# Altium schematic sheet POWER_RK806.SchDoc (part 2 of 2)
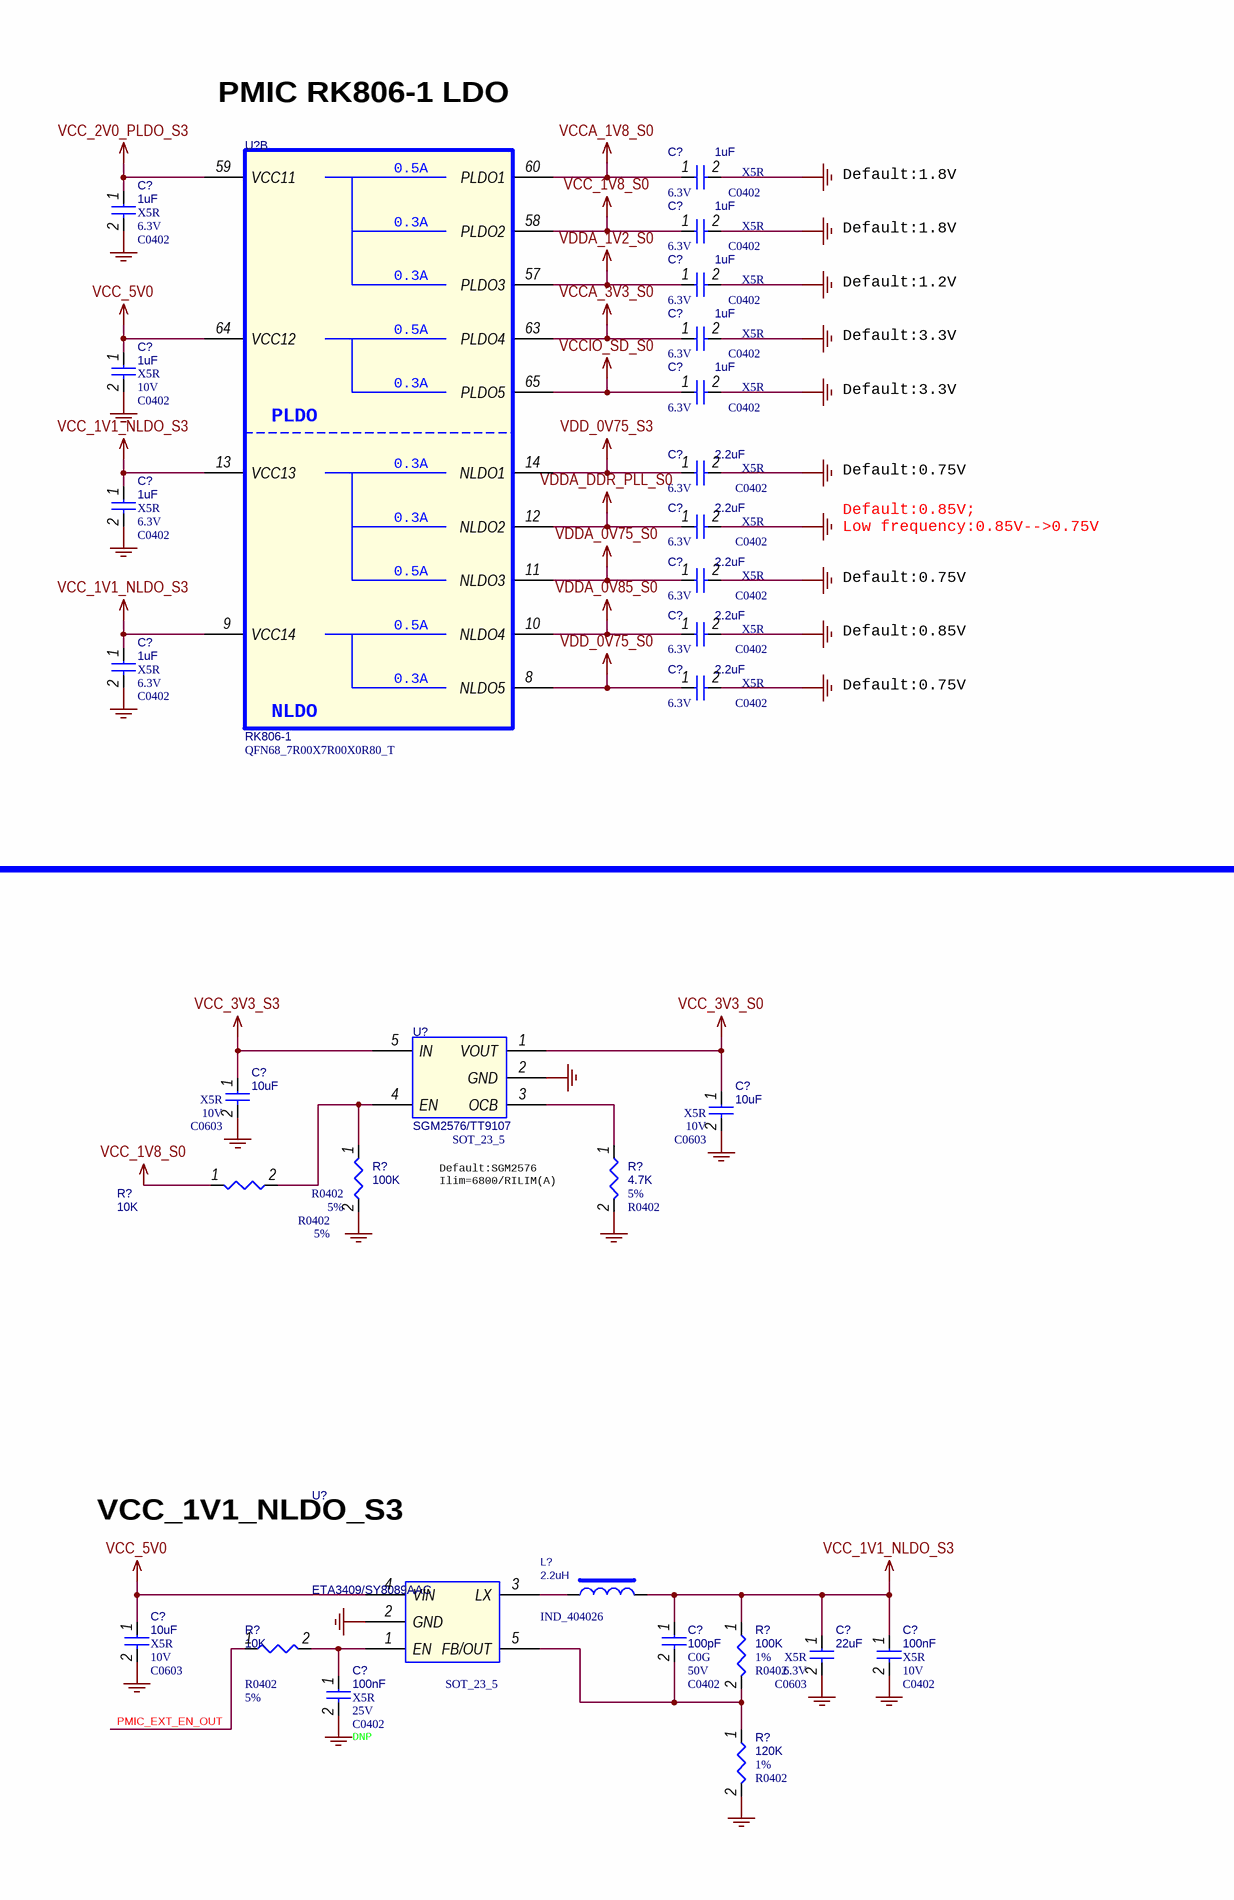
[diagram p2: POWER_RK806.SchDoc, right]

## Library data of the parts
C?#1 = CAP NP_Dup1: cap,10.00uF,+/-10%,10V,X5R,C0603; Part Reference: C2200; Manufacturer PN: C1608X5R1A106K080AC; Manufacturer: TDK; Tolerance: 10%; C_Voltage: 6.3V; Priority: A; PCB Footprint: C0603; Value: 10uF; Created by: JJJ; Part Type: C0603; RK PN: C1608X5R1A106K080AC
C?#2 = CAP NP_Dup1: cap,22.00uF,+/-10%,10V,X5R,C0805; Part Reference: C2201; Manufacturer: TDK; RK PN: C2012X5R1A226K125AB; Priority: A; C_Voltage: 6.3V; Tolerance: 10%; PCB Footprint: C0805; Value: 22uF; Part Type: C0805; Manufacturer PN: C2012X5R1A226K125AB; Created by: JJJ
C?#3 = CAP NP_Dup1: cap,22.00uF,+/-20%,6.3V,X5R,C0603; Part Reference: C2202; Manufacturer: TDK; RK PN: C1608X5R0J226M080AC; Priority: A; Tolerance: 20%; PCB Footprint: C0603; Value: 22uF; Part Type: C0603; C_Voltage: 6.3V; Manufacturer PN: C1608X5R0J226M080AC; Created by: JJJ
C?#4 = CAP NP_Dup1: cap,22.00uF,+/-20%,6.3V,X5R,C0603; Part Reference: C2203; Manufacturer PN: C1608X5R0J226M080AC; Manufacturer: TDK; Tolerance: 20%; Priority: A; PCB Footprint: C0603; Value: 22uF; Created by: JJJ; C_Voltage: 6.3V; Part Type: C0603; RK PN: C1608X5R0J226M080AC
C?#5 = CAP NP_Dup1: cap,10.00uF,+/-10%,6.3V,X5R,C0603; Part Reference: C2204; Manufacturer PN: C1608X5R0J106K080AB; Manufacturer: TDK; Tolerance: 10%; Priority: A; PCB Footprint: C0603; Value: 10uF; Created by: JJJ; C_Voltage: 6.3V; Part Type: C0603; RK PN: C1608X5R0J106K080AB
C?#6 = CAP NP_Dup1: cap,1.00uF,+/-10%,10V,X5R,C0402; Part Reference: C2206; Manufacturer: TDK; RK PN: C1005X5R1A105K050BB; Priority: A; Tolerance: 10%; PCB Footprint: C0402; Value: 1uF; Part Type: C0402; Manufacturer PN: C1005X5R1A105K050BB; Created by: JJJ
C?#7 = CAP NP_Dup1: cap,47.00uF,+/-20%,6.3V,X5R,C0805; Part Reference: C2207; Manufacturer: TDK; RK PN: C2012X5R0J476M125AC; Priority: A; Tolerance: 20%; PCB Footprint: C0805; Value: 47uF; Part Type: C0805; C_Voltage: 6.3V; Manufacturer PN: C2012X5R0J476M125AC; Created by: JJJ
C?#8 = CAP NP_Dup1: cap,47.00uF,+/-20%,6.3V,X5R,C0805; Part Reference: C2208; Manufacturer: TDK; RK PN: C2012X5R0J476M125AC; Priority: A; Tolerance: 20%; PCB Footprint: C0805; Value: 47uF; Part Type: C0805; C_Voltage: 6.3V; Manufacturer PN: C2012X5R0J476M125AC; Created by: JJJ
C?#9 = CAP NP_Dup1: cap,22.00uF,+/-20%,6.3V,X5R,C0603; Part Reference: C2211; Manufacturer: TDK; RK PN: C1608X5R0J226M080AC; Priority: A; Tolerance: 20%; PCB Footprint: C0603; Value: 22uF; Part Type: C0603; C_Voltage: 6.3V; Manufacturer PN: C1608X5R0J226M080AC; Created by: JJJ
C?#10 = CAP NP_Dup1: cap,22.00uF,+/-20%,6.3V,X5R,C0603; Part Reference: C2209; Manufacturer: TDK; RK PN: C1608X5R0J226M080AC; Priority: A; Tolerance: 20%; PCB Footprint: C0603; Value: 22uF; Part Type: C0603; C_Voltage: 6.3V; Manufacturer PN: C1608X5R0J226M080AC; Created by: JJJ
C?#11 = CAP NP_Dup1: cap,1.00uF,+/-10%,10V,X5R,C0402; Part Reference: C2205; Manufacturer: TDK; RK PN: C1005X5R1A105K050BB; Priority: A; Tolerance: 10%; PCB Footprint: C0402; Value: 1uF; Part Type: C0402; Manufacturer PN: C1005X5R1A105K050BB; Created by: JJJ
C?#12 = CAP NP_Dup1: cap,10.00uF,+/-10%,10V,X5R,C0603; Part Reference: C2210; Manufacturer PN: C1608X5R1A106K080AC; Manufacturer: TDK; Tolerance: 10%; C_Voltage: 6.3V; Priority: A; PCB Footprint: C0603; Value: 10uF; Created by: JJJ; Part Type: C0603; RK PN: C1608X5R1A106K080AC
C?#13 = CAP NP_Dup1: cap,22.00uF,+/-10%,10V,X5R,C0805; Part Reference: C2212; Manufacturer: TDK; RK PN: C2012X5R1A226K125AB; Priority: A; C_Voltage: 6.3V; Tolerance: 10%; PCB Footprint: C0805; Value: 22uF; Part Type: C0805; Manufacturer PN: C2012X5R1A226K125AB; Created by: JJJ
C?#14 C?#16 C?#26 C?#27 C?#29 = CAP NP_Dup1: cap,1.00uF,+/-10%,6.3V,X5R,C0402; Part Reference: C2253; Manufacturer PN: C1005X5R0J105K050BB; Manufacturer: TDK; Tolerance: 10%; Priority: A; PCB Footprint: C0402; Value: 1uF; Created by: JJJ; C_Voltage: 6.3V; Part Type: C0402; RK PN: C1005X5R0J105K050BB
C?#15 = CAP NP_Dup1: cap,1.00uF,+/-10%,6.3V,X5R,C0402; Part Reference: C2252; Manufacturer: TDK; RK PN: C1005X5R0J105K050BB; Priority: A; Tolerance: 10%; PCB Footprint: C0402; Value: 1uF; Part Type: C0402; C_Voltage: 6.3V; Manufacturer PN: C1005X5R0J105K050BB; Created by: JJJ
C?#17 = CAP NP_Dup1: cap,22.00uF,+/-20%,6.3V,X5R,C0603; Part Reference: C2213; Manufacturer: TDK; RK PN: C1608X5R0J226M080AC; Priority: A; Tolerance: 20%; PCB Footprint: C0603; Value: 22uF; Part Type: C0603; C_Voltage: 6.3V; Manufacturer PN: C1608X5R0J226M080AC; Created by: JJJ
C?#18 = CAP NP_Dup1: cap,22.00uF,+/-20%,6.3V,X5R,C0603; Part Reference: C2214; Manufacturer PN: C1608X5R0J226M080AC; Manufacturer: TDK; Tolerance: 20%; Priority: A; PCB Footprint: C0603; Value: 22uF; Created by: JJJ; C_Voltage: 6.3V; Part Type: C0603; RK PN: C1608X5R0J226M080AC
C?#19 = CAP NP_Dup1: cap,10.00uF,+/-10%,6.3V,X5R,C0603; Part Reference: C2215; Manufacturer PN: C1608X5R0J106K080AB; Manufacturer: TDK; Tolerance: 10%; Priority: A; PCB Footprint: C0603; Value: 10uF; Created by: JJJ; C_Voltage: 6.3V; Part Type: C0603; RK PN: C1608X5R0J106K080AB
C?#20 = CAP NP_Dup1: cap,1.00uF,+/-10%,10V,X5R,C0402; Part Reference: C2217; Manufacturer: TDK; RK PN: C1005X5R1A105K050BB; Priority: A; Tolerance: 10%; PCB Footprint: C0402; Value: 1uF; Part Type: C0402; Manufacturer PN: C1005X5R1A105K050BB; Created by: JJJ
C?#21 = CAP NP_Dup1: cap,22.00uF,+/-20%,6.3V,X5R,C0603; Part Reference: C2218; Manufacturer PN: C1608X5R0J226M080AC; Manufacturer: TDK; Tolerance: 20%; Priority: A; PCB Footprint: C0603; Value: 22uF; Created by: JJJ; C_Voltage: 6.3V; Part Type: C0603; RK PN: C1608X5R0J226M080AC
C?#22 = CAP NP_Dup1: cap,22.00uF,+/-20%,6.3V,X5R,C0603; Part Reference: C2219; Manufacturer: TDK; RK PN: C1608X5R0J226M080AC; Priority: A; Tolerance: 20%; PCB Footprint: C0603; Value: 22uF; Part Type: C0603; C_Voltage: 6.3V; Manufacturer PN: C1608X5R0J226M080AC; Created by: JJJ
C?#23 = CAP NP_Dup1: cap,22.00uF,+/-20%,6.3V,X5R,C0603; Part Reference: C2220; Manufacturer PN: C1608X5R0J226M080AC; Manufacturer: TDK; Tolerance: 20%; Priority: A; PCB Footprint: C0603; Value: 22uF; Created by: JJJ; C_Voltage: 6.3V; Part Type: C0603; RK PN: C1608X5R0J226M080AC
C?#24 = CAP NP_Dup1: cap,22.00uF,+/-20%,6.3V,X5R,C0603; Part Reference: C2221; Manufacturer PN: C1608X5R0J226M080AC; Manufacturer: TDK; Tolerance: 20%; Priority: A; PCB Footprint: C0603; Value: 22uF; Created by: JJJ; C_Voltage: 6.3V; Part Type: C0603; RK PN: C1608X5R0J226M080AC
C?#25 = CAP NP_Dup1: cap,100.00pF,+/-10%,50V,C0G,C0402; Part Reference: C2216; Manufacturer: TDK; RK PN: C1005C0G1H101K050BA; Priority: A; Tolerance: 10%; PCB Footprint: C0402; Value: 100pF; Part Type: C0402; Manufacturer PN: C1005C0G1H101K050BA; Created by: JJJ
C?#28 = CAP NP_Dup1: cap,1.00uF,+/-10%,10V,X5R,C0402; Part Reference: C2258; Manufacturer: TDK; RK PN: C1005X5R1A105K050BB; Priority: A; C_Voltage: 6.3V; Tolerance: 10%; PCB Footprint: C0402; Value: 1uF; Part Type: C0402; Manufacturer PN: C1005X5R1A105K050BB; Created by: JJJ
C?#30 = CAP NP_Dup1: cap,10.00uF,+/-10%,10V,X5R,C0603; Part Reference: C2222; Manufacturer PN: C1608X5R1A106K080AC; Manufacturer: TDK; Tolerance: 10%; C_Voltage: 6.3V; Priority: A; PCB Footprint: C0603; Value: 10uF; Created by: JJJ; Part Type: C0603; RK PN: C1608X5R1A106K080AC
C?#31 = CAP NP_Dup1: cap,22.00uF,+/-10%,10V,X5R,C0805; Part Reference: C2223; Manufacturer: TDK; RK PN: C2012X5R1A226K125AB; Priority: A; C_Voltage: 6.3V; Tolerance: 10%; PCB Footprint: C0805; Value: 22uF; Part Type: C0805; Manufacturer PN: C2012X5R1A226K125AB; Created by: JJJ
C?#32 C?#37 C?#44 C?#45 C?#47 = CAP NP_Dup1: cap,2.20uF,+/-10%,6.3V,X5R,C0402; Part Reference: C2262; Manufacturer: TDK; RK PN: C1005X5R0J225K050BC; Priority: A; Tolerance: 10%; PCB Footprint: C0402; Value: 2.2uF; Part Type: C0402; C_Voltage: 6.3V; Manufacturer PN: C1005X5R0J225K050BC; Created by: JJJ
C?#33 = CAP NP_Dup1: cap,1.00uF,+/-10%,6.3V,X5R,C0402; Part Reference: C2263; Manufacturer: TDK; RK PN: C1005X5R0J105K050BB; Priority: A; Tolerance: 10%; PCB Footprint: C0402; Value: 1uF; Part Type: C0402; C_Voltage: 6.3V; Manufacturer PN: C1005X5R0J105K050BB; Created by: JJJ
C?#34 = CAP NP_Dup1: cap,22.00uF,+/-20%,6.3V,X5R,C0603; Part Reference: C2224; Manufacturer: TDK; RK PN: C1608X5R0J226M080AC; Priority: A; Tolerance: 20%; PCB Footprint: C0603; Value: 22uF; Part Type: C0603; C_Voltage: 6.3V; Manufacturer PN: C1608X5R0J226M080AC; Created by: JJJ
C?#35 = CAP NP_Dup1: cap,22.00uF,+/-20%,6.3V,X5R,C0603; Part Reference: C2225; Manufacturer PN: C1608X5R0J226M080AC; Manufacturer: TDK; Tolerance: 20%; Priority: A; PCB Footprint: C0603; Value: 22uF; Created by: JJJ; C_Voltage: 6.3V; Part Type: C0603; RK PN: C1608X5R0J226M080AC
C?#36 = CAP NP_Dup1: cap,10.00uF,+/-10%,6.3V,X5R,C0603; Part Reference: C2226; Manufacturer PN: C1608X5R0J106K080AB; Manufacturer: TDK; Tolerance: 10%; Priority: A; PCB Footprint: C0603; Value: 10uF; Created by: JJJ; C_Voltage: 6.3V; Part Type: C0603; RK PN: C1608X5R0J106K080AB
C?#38 = CAP NP_Dup1: cap,100.00pF,+/-10%,50V,C0G,C0402; Part Reference: C2233; Manufacturer: TDK; RK PN: C1005C0G1H101K050BA; Priority: A; Tolerance: 10%; PCB Footprint: C0402; Value: 100pF; Part Type: C0402; Manufacturer PN: C1005C0G1H101K050BA; Created by: JJJ
C?#39 = CAP NP_Dup1: cap,22.00uF,+/-20%,6.3V,X5R,C0603; Part Reference: C2229; Manufacturer: TDK; RK PN: C1608X5R0J226M080AC; Priority: A; Tolerance: 20%; PCB Footprint: C0603; Value: 22uF; Part Type: C0603; C_Voltage: 6.3V; Manufacturer PN: C1608X5R0J226M080AC; Created by: JJJ
C?#40 = CAP NP_Dup1: cap,22.00uF,+/-20%,6.3V,X5R,C0603; Part Reference: C2230; Manufacturer: TDK; RK PN: C1608X5R0J226M080AC; Priority: A; Tolerance: 20%; PCB Footprint: C0603; Value: 22uF; Part Type: C0603; C_Voltage: 6.3V; Manufacturer PN: C1608X5R0J226M080AC; Created by: JJJ
C?#41 = CAP NP_Dup1: cap,22.00uF,+/-20%,6.3V,X5R,C0603; Part Reference: C2231; Manufacturer: TDK; RK PN: C1608X5R0J226M080AC; Priority: A; Tolerance: 20%; PCB Footprint: C0603; Value: 22uF; Part Type: C0603; C_Voltage: 6.3V; Manufacturer PN: C1608X5R0J226M080AC; Created by: JJJ
C?#42 = CAP NP_Dup1: cap,22.00uF,+/-20%,6.3V,X5R,C0603; Part Reference: C2232; Manufacturer PN: C1608X5R0J226M080AC; Manufacturer: TDK; Tolerance: 20%; Priority: A; PCB Footprint: C0603; Value: 22uF; Created by: JJJ; C_Voltage: 6.3V; Part Type: C0603; RK PN: C1608X5R0J226M080AC
C?#43 = CAP NP_Dup1: cap,1.00uF,+/-10%,10V,X5R,C0402; Part Reference: C2228; Manufacturer PN: C1005X5R1A105K050BB; Manufacturer: TDK; Tolerance: 10%; Priority: A; PCB Footprint: C0402; Value: 1uF; Created by: JJJ; Part Type: C0402; RK PN: C1005X5R1A105K050BB
C?#46 = CAP NP_Dup1: cap,1.00uF,+/-10%,6.3V,X5R,C0402; Part Reference: C2270; Manufacturer: TDK; RK PN: C1005X5R0J105K050BB; Priority: A; Tolerance: 10%; PCB Footprint: C0402; Value: 1uF; Part Type: C0402; C_Voltage: 6.3V; Manufacturer PN: C1005X5R0J105K050BB; Created by: JJJ
C?#48 = CAP NP_Dup1: cap,10.00uF,+/-10%,10V,X5R,C0603; Part Reference: C2234; Manufacturer PN: C1608X5R1A106K080AC; Manufacturer: TDK; Tolerance: 10%; C_Voltage: 6.3V; Priority: A; PCB Footprint: C0603; Value: 10uF; Created by: JJJ; Part Type: C0603; RK PN: C1608X5R1A106K080AC
C?#49 = CAP NP_Dup1: cap,22.00uF,+/-10%,10V,X5R,C0805; Part Reference: C2235; Manufacturer: TDK; RK PN: C2012X5R1A226K125AB; Priority: A; C_Voltage: 6.3V; Tolerance: 10%; PCB Footprint: C0805; Value: 22uF; Part Type: C0805; Manufacturer PN: C2012X5R1A226K125AB; Created by: JJJ
C?#50 = CAP NP_Dup1: cap,22.00uF,+/-20%,6.3V,X5R,C0603; Part Reference: C2236; Manufacturer PN: C1608X5R0J226M080AC; Manufacturer: TDK; Tolerance: 20%; Priority: A; PCB Footprint: C0603; Value: 22uF; Created by: JJJ; C_Voltage: 6.3V; Part Type: C0603; RK PN: C1608X5R0J226M080AC
C?#51 = CAP NP_Dup1: cap,22.00uF,+/-20%,6.3V,X5R,C0603; Part Reference: C2237; Manufacturer PN: C1608X5R0J226M080AC; Manufacturer: TDK; Tolerance: 20%; Priority: A; PCB Footprint: C0603; Value: 22uF; Created by: JJJ; C_Voltage: 6.3V; Part Type: C0603; RK PN: C1608X5R0J226M080AC
C?#52 = CAP NP_Dup1: cap,1.00uF,+/-10%,10V,X5R,C0402; Part Reference: C2239; Manufacturer: TDK; RK PN: C1005X5R1A105K050BB; Priority: A; Tolerance: 10%; PCB Footprint: C0402; Value: 1uF; Part Type: C0402; Manufacturer PN: C1005X5R1A105K050BB; Created by: JJJ
C?#53 = CAP NP_Dup1: cap,22.00uF,+/-20%,6.3V,X5R,C0603; Part Reference: C2240; Manufacturer PN: C1608X5R0J226M080AC; Manufacturer: TDK; Tolerance: 20%; Priority: A; PCB Footprint: C0603; Value: 22uF; Created by: JJJ; C_Voltage: 6.3V; Part Type: C0603; RK PN: C1608X5R0J226M080AC
C?#54 = CAP NP_Dup1: cap,22.00uF,+/-20%,6.3V,X5R,C0603; Part Reference: C2241; Manufacturer PN: C1608X5R0J226M080AC; Manufacturer: TDK; Tolerance: 20%; Priority: A; PCB Footprint: C0603; Value: 22uF; Created by: JJJ; C_Voltage: 6.3V; Part Type: C0603; RK PN: C1608X5R0J226M080AC
C?#55 = CAP NP_Dup1: cap,22.00uF,+/-20%,6.3V,X5R,C0603; Part Reference: C2242; Manufacturer: TDK; RK PN: C1608X5R0J226M080AC; Priority: A; Tolerance: 20%; PCB Footprint: C0603; Value: 22uF; Part Type: C0603; C_Voltage: 6.3V; Manufacturer PN: C1608X5R0J226M080AC; Created by: JJJ
C?#56 = CAP NP_Dup1: cap,22.00uF,+/-20%,6.3V,X5R,C0603; Part Reference: C2243; Manufacturer: TDK; RK PN: C1608X5R0J226M080AC; Priority: A; Tolerance: 20%; PCB Footprint: C0603; Value: 22uF; Part Type: C0603; C_Voltage: 6.3V; Manufacturer PN: C1608X5R0J226M080AC; Created by: JJJ
C?#57 = CAP NP_Dup1: cap,10.00uF,+/-10%,10V,X5R,C0603; Part Reference: C2244; Manufacturer: TDK; RK PN: C1608X5R1A106K080AC; Priority: A; C_Voltage: 6.3V; Tolerance: 10%; PCB Footprint: C0603; Value: 10uF; Part Type: C0603; Manufacturer PN: C1608X5R1A106K080AC; Created by: JJJ
C?#58 = CAP NP_Dup1: cap,10.00uF,+/-10%,10V,X5R,C0603; Part Reference: C2245; Manufacturer: TDK; RK PN: C1608X5R1A106K080AC; Priority: A; C_Voltage: 6.3V; Tolerance: 10%; PCB Footprint: C0603; Value: 10uF; Part Type: C0603; Manufacturer PN: C1608X5R1A106K080AC; Created by: JJJ
C?#59 = CAP NP_Dup1: cap,22.00uF,+/-20%,6.3V,X5R,C0603; Part Reference: C2246; Manufacturer PN: C1608X5R0J226M080AC; Manufacturer: TDK; Tolerance: 20%; Priority: A; PCB Footprint: C0603; Value: 22uF; Created by: JJJ; C_Voltage: 6.3V; Part Type: C0603; RK PN: C1608X5R0J226M080AC
C?#60 = CAP NP_Dup1: cap,22.00uF,+/-20%,6.3V,X5R,C0603; Part Reference: C2247; Manufacturer PN: C1608X5R0J226M080AC; Manufacturer: TDK; Tolerance: 20%; Priority: A; PCB Footprint: C0603; Value: 22uF; Created by: JJJ; C_Voltage: 6.3V; Part Type: C0603; RK PN: C1608X5R0J226M080AC
C?#61 = CAP NP_Dup1: cap,22.00uF,+/-20%,6.3V,X5R,C0603; Part Reference: C2249; Manufacturer: TDK; RK PN: C1608X5R0J226M080AC; Priority: A; Tolerance: 20%; PCB Footprint: C0603; Value: 22uF; Part Type: C0603; C_Voltage: 6.3V; Manufacturer PN: C1608X5R0J226M080AC; Created by: JJJ
C?#62 = CAP NP_Dup1: cap,22.00uF,+/-20%,6.3V,X5R,C0603; Part Reference: C2250; Manufacturer: TDK; RK PN: C1608X5R0J226M080AC; Priority: A; Tolerance: 20%; PCB Footprint: C0603; Value: 22uF; Part Type: C0603; C_Voltage: 6.3V; Manufacturer PN: C1608X5R0J226M080AC; Created by: JJJ
C?#63 = CAP NP_Dup1: cap,10.00uF,+/-10%,10V,X5R,C0603; Part Reference: C2330; Manufacturer PN: C1608X5R1A106K080AC; Manufacturer: TDK; Tolerance: 10%; C_Voltage: 6.3V; Priority: A; PCB Footprint: C0603; Value: 10uF; Created by: JJJ; Part Type: C0603; RK PN: C1608X5R1A106K080AC
C?#64 = CAP NP_Dup1: cap,10.00uF,+/-10%,10V,X5R,C0603; Part Reference: C2332; Manufacturer PN: C1608X5R1A106K080AC; Manufacturer: TDK; Tolerance: 10%; C_Voltage: 6.3V; Priority: A; PCB Footprint: C0603; Value: 10uF; Created by: JJJ; Part Type: C0603; RK PN: C1608X5R1A106K080AC
C?#65 = CAP NP_Dup1: cap,22.00uF,+/-10%,10V,X5R,C0805; Part Reference: C2300; Manufacturer PN: C2012X5R1A226K125AB; Manufacturer: TDK; Tolerance: 10%; Priority: A; PCB Footprint: C0805; Value: 22uF; Created by: JJJ; Part Type: C0805; RK PN: C2012X5R1A226K125AB
C?#66 = CAP NP_Dup1: cap,22.00uF,+/-10%,10V,X5R,C0805; Part Reference: C2301; Manufacturer PN: C2012X5R1A226K125AB; Manufacturer: TDK; Tolerance: 10%; Priority: A; PCB Footprint: C0805; Value: 22uF; Created by: JJJ; Part Type: C0805; RK PN: C2012X5R1A226K125AB
C?#67 = CAP NP_Dup1: cap,22.00uF,+/-10%,10V,X5R,C0805; Part Reference: C2317; Manufacturer PN: C2012X5R1A226K125AB; Manufacturer: TDK; Tolerance: 10%; Priority: A; PCB Footprint: C0805; Value: 22uF; Created by: JJJ; Part Type: C0805; RK PN: C2012X5R1A226K125AB
C?#68 = CAP NP_Dup1: cap,22.00uF,+/-10%,10V,X5R,C0805; Part Reference: C2318; Manufacturer PN: C2012X5R1A226K125AB; Manufacturer: TDK; Tolerance: 10%; Priority: A; PCB Footprint: C0805; Value: 22uF; Created by: JJJ; Part Type: C0805; RK PN: C2012X5R1A226K125AB
C?#69 = CAP NP_Dup1: cap,1.00uF,+/-10%,10V,X5R,C0402; Part Reference: C2304; Manufacturer: TDK; RK PN: C1005X5R1A105K050BB; Priority: A; Tolerance: 10%; PCB Footprint: C0402; Value: 1uF; Part Type: C0402; Manufacturer PN: C1005X5R1A105K050BB; Created by: JJJ
C?#70 = CAP NP_Dup1: cap,22.00uF,+/-20%,6.3V,X5R,C0603; Part Reference: C2305; Manufacturer: TDK; RK PN: C1608X5R0J226M080AC; Priority: A; Tolerance: 20%; PCB Footprint: C0603; Value: 22uF; Part Type: C0603; C_Voltage: 6.3V; Manufacturer PN: C1608X5R0J226M080AC; Created by: JJJ
C?#71 = CAP NP_Dup1: cap,22.00uF,+/-20%,6.3V,X5R,C0603; Part Reference: C2306; Manufacturer PN: C1608X5R0J226M080AC; Manufacturer: TDK; Tolerance: 20%; Priority: A; Number: 37; PCB Footprint: C0603; Value: 22uF; Created by: JJJ; C_Voltage: 6.3V; Part Type: C0603; RK PN: C1608X5R0J226M080AC
C?#72 = CAP NP_Dup1: cap,22.00uF,+/-20%,6.3V,X5R,C0603; Part Reference: C2307; Manufacturer PN: C1608X5R0J226M080AC; Manufacturer: TDK; Tolerance: 20%; Priority: A; PCB Footprint: C0603; Value: 22uF; Created by: JJJ; C_Voltage: 6.3V; Part Type: C0603; RK PN: C1608X5R0J226M080AC
C?#73 = CAP NP_Dup1: cap,22.00uF,+/-20%,6.3V,X5R,C0603; Part Reference: C2308; Manufacturer PN: C1608X5R0J226M080AC; Manufacturer: TDK; Tolerance: 20%; Priority: A; PCB Footprint: C0603; Value: 22uF; Created by: JJJ; Part Type: C0603; RK PN: C1608X5R0J226M080AC
C?#74 = CAP NP_Dup1: cap,22.00uF,+/-20%,6.3V,X5R,C0603; Part Reference: C2309; Manufacturer PN: C1608X5R0J226M080AC; Manufacturer: TDK; Tolerance: 20%; Priority: A; PCB Footprint: C0603; Value: 22uF; Created by: JJJ; Part Type: C0603; RK PN: C1608X5R0J226M080AC
C?#75 = CAP NP_Dup1: cap,1.00uF,+/-10%,10V,X5R,C0402; Part Reference: C2323; Manufacturer PN: C1005X5R1A105K050BB; Manufacturer: TDK; Tolerance: 10%; Priority: A; PCB Footprint: C0402; Value: 1uF; Created by: JJJ; Part Type: C0402; RK PN: C1005X5R1A105K050BB
C?#76 = CAP NP_Dup1: cap,47.00uF,+/-20%,6.3V,X5R,C0805; Part Reference: C2324; Manufacturer PN: C2012X5R0J476M125AC; Manufacturer: TDK; Tolerance: 20%; Priority: A; PCB Footprint: C0805; Value: 47uF; Created by: JJJ; C_Voltage: 6.3V; Part Type: C0805; RK PN: C2012X5R0J476M125AC
C?#77 = CAP NP_Dup1: cap,47.00uF,+/-20%,6.3V,X5R,C0805; Part Reference: C2325; Manufacturer: TDK; Number: 37; RK PN: C2012X5R0J476M125AC; Priority: A; Tolerance: 20%; PCB Footprint: C0805; Value: 47uF; Part Type: C0805; Manufacturer PN: C2012X5R0J476M125AC; C_Voltage: 6.3V; Created by: JJJ
C?#78 = CAP NP_Dup1: cap,22.00uF,+/-20%,6.3V,X5R,C0603; Part Reference: C2326; Manufacturer: TDK; RK PN: C1608X5R0J226M080AC; Priority: A; Tolerance: 20%; PCB Footprint: C0603; Value: 22uF; Part Type: C0603; C_Voltage: 6.3V; Manufacturer PN: C1608X5R0J226M080AC; Created by: JJJ
C?#79 = CAP NP_Dup1: cap,22.00uF,+/-20%,6.3V,X5R,C0603; Part Reference: C2327; Manufacturer: TDK; RK PN: C1608X5R0J226M080AC; Priority: A; Tolerance: 20%; PCB Footprint: C0603; Value: 22uF; Part Type: C0603; Manufacturer PN: C1608X5R0J226M080AC; Created by: JJJ
C?#80 = CAP NP_Dup1: cap,22.00uF,+/-20%,6.3V,X5R,C0603; Part Reference: C2328; Manufacturer PN: C1608X5R0J226M080AC; Manufacturer: TDK; Tolerance: 20%; Priority: A; PCB Footprint: C0603; Value: 22uF; Created by: JJJ; Part Type: C0603; RK PN: C1608X5R0J226M080AC
C?#81 = CAP NP_Dup1: cap,10.00uF,+/-10%,10V,X5R,C0603; Part Reference: C2319; Manufacturer PN: C1608X5R1A106K080AC; Manufacturer: TDK; Tolerance: 10%; Priority: A; PCB Footprint: C0603; Value: 10uF; Created by: JJJ; Part Type: C0603; RK PN: C1608X5R1A106K080AC
C?#82 = CAP NP_Dup1: cap,100.00pF,+/-10%,50V,C0G,C0402; Part Reference: C2320; Manufacturer PN: C1005C0G1H101K050BA; Manufacturer: TDK; Tolerance: 10%; Priority: A; PCB Footprint: C0402; Value: 100pF; Created by: JJJ; Part Type: C0402; RK PN: C1005C0G1H101K050BA
C?#83 = CAP NP_Dup1: cap,22.00uF,+/-20%,6.3V,X5R,C0603; Part Reference: C2321; Manufacturer: TDK; RK PN: C1608X5R0J226M080AC; Priority: A; Tolerance: 20%; PCB Footprint: C0603; Value: 22uF; Part Type: C0603; C_Voltage: 6.3V; Manufacturer PN: C1608X5R0J226M080AC; Created by: JJJ
C?#84 = CAP NP_Dup1: cap,100.00nF,+/-10%,10V,X5R,C0402; Part Reference: C2322; Manufacturer PN: C1005X5R1A104K050BA; Manufacturer: TDK; C_Voltage: 6.3V; Tolerance: 10%; Priority: A; Number: 37; PCB Footprint: C0402; Value: 100nF; Created by: JJJ; Part Type: C0402; RK PN: C1005X5R1A104K050BA
C?#85 = CAP NP_Dup1: cap,100.00nF,+/-10%,25V,X5R,C0402; Part Reference: C2329; Manufacturer: TDK; Number: 37; RK PN: C1005X5R1E104K050BC; Priority: A; Tolerance: 10%; C_Voltage: 6.3V; PCB Footprint: C0402; Value: 100nF; Part Type: C0402; Manufacturer PN: C1005X5R1E104K050BC; Created by: JJJ
C?#86 = CAP NP_Dup1: cap,22.00uF,+/-10%,10V,X5R,C0805; Part Reference: C2302; Manufacturer PN: C2012X5R1A226K125AB; Manufacturer: TDK; Tolerance: 10%; Priority: A; PCB Footprint: C0805; Value: 22uF; Created by: JJJ; Part Type: C0805; RK PN: C2012X5R1A226K125AB
C?#87 = CAP NP_Dup1: cap,22.00uF,+/-10%,10V,X5R,C0805; Part Reference: C2303; Manufacturer PN: C2012X5R1A226K125AB; Manufacturer: TDK; Tolerance: 10%; Priority: A; PCB Footprint: C0805; Value: 22uF; Created by: JJJ; Part Type: C0805; RK PN: C2012X5R1A226K125AB
C?#88 = CAP NP_Dup1: cap,1.00uF,+/-10%,6.3V,X5R,C0402; Part Reference: C2256; Manufacturer: TDK; RK PN: C1005X5R0J105K050BB; Priority: A; Tolerance: 10%; PCB Footprint: C0402; Value: 1uF; Part Type: C0402; C_Voltage: 6.3V; Manufacturer PN: C1005X5R0J105K050BB; Created by: JJJ
C?#89 = CAP NP_Dup1: cap,1.00uF,+/-10%,10V,X5R,C0402; Part Reference: C2310; Manufacturer: TDK; RK PN: C1005X5R1A105K050BB; Priority: A; Tolerance: 10%; PCB Footprint: C0402; Value: 1uF; Part Type: C0402; Manufacturer PN: C1005X5R1A105K050BB; Created by: JJJ
C?#90 = CAP NP_Dup1: cap,22.00uF,+/-20%,6.3V,X5R,C0603; Part Reference: C2311; Manufacturer: TDK; RK PN: C1608X5R0J226M080AC; Priority: A; Tolerance: 20%; PCB Footprint: C0603; Value: 22uF; Part Type: C0603; C_Voltage: 6.3V; Manufacturer PN: C1608X5R0J226M080AC; Created by: JJJ
C?#91 = CAP NP_Dup1: cap,22.00uF,+/-20%,6.3V,X5R,C0603; Part Reference: C2312; Manufacturer PN: C1608X5R0J226M080AC; Manufacturer: TDK; Tolerance: 20%; Priority: A; Number: 37; PCB Footprint: C0603; Value: 22uF; Created by: JJJ; C_Voltage: 6.3V; Part Type: C0603; RK PN: C1608X5R0J226M080AC
C?#92 = CAP NP_Dup1: cap,22.00uF,+/-20%,6.3V,X5R,C0603; Part Reference: C2313; Manufacturer PN: C1608X5R0J226M080AC; Manufacturer: TDK; Tolerance: 20%; Priority: A; PCB Footprint: C0603; Value: 22uF; Created by: JJJ; C_Voltage: 6.3V; Part Type: C0603; RK PN: C1608X5R0J226M080AC
C?#93 = CAP NP_Dup1: cap,22.00uF,+/-20%,6.3V,X5R,C0603; Part Reference: C2314; Manufacturer PN: C1608X5R0J226M080AC; Manufacturer: TDK; Tolerance: 20%; Priority: A; PCB Footprint: C0603; Value: 22uF; Created by: JJJ; Part Type: C0603; RK PN: C1608X5R0J226M080AC
C?#94 = CAP NP_Dup1: cap,22.00uF,+/-20%,6.3V,X5R,C0603; Part Reference: C2315; Manufacturer PN: C1608X5R0J226M080AC; Manufacturer: TDK; Tolerance: 20%; Priority: A; PCB Footprint: C0603; Value: 22uF; Created by: JJJ; Part Type: C0603; RK PN: C1608X5R0J226M080AC
C?#95 = CAP NP_Dup1: cap,1.00uF,+/-10%,10V,X5R,C0402; Part Reference: C2260; Manufacturer PN: C1005X5R1A105K050BB; Manufacturer: TDK; Tolerance: 10%; C_Voltage: 6.3V; Priority: A; PCB Footprint: C0402; Value: 1uF; Created by: JJJ; Part Type: C0402; RK PN: C1005X5R1A105K050BB
C?#96 = CAP NP_Dup1: cap,4.70uF,+/-10%,10V,X5R,C0402; Part Reference: C2261; Manufacturer PN: C1005X5R1A475K050BC; Manufacturer: TDK; Tolerance: 10%; Priority: A; PCB Footprint: C0402; Value: 4.7uF; Created by: JJJ; Part Type: C0402; RK PN: C1005X5R1A475K050BC
C?#97 = CAP NP_Dup1: cap,1.00nF,+/-5%,25V,C0G,C0402; Part Reference: C2265; Manufacturer: TDK; RK PN: C1005C0G1E102J050BA; Priority: A; Tolerance: 5%; PCB Footprint: C0402; Value: 1nF; Part Type: C0402; Manufacturer PN: C1005C0G1E102J050BA; Created by: JJJ
C?#98 = CAP NP_Dup1: cap,10.00nF,+/-10%,25V,X5R,C0402; Part Reference: C2266; Manufacturer PN: C1005X5R1E103K050BA; Manufacturer: TDK; Tolerance: 10%; C_Voltage: 6.3V; Priority: A; PCB Footprint: C0402; Value: 10nF; Created by: JJJ; Part Type: C0402; RK PN: C1005X5R1E103K050BA
C?#99 = CAP NP_Dup1: cap,1.00nF,+/-5%,25V,C0G,C0402; Part Reference: C2268; Manufacturer PN: C1005C0G1E102J050BA; Manufacturer: TDK; Tolerance: 5%; Priority: A; PCB Footprint: C0402; Value: 1nF; Created by: JJJ; Part Type: C0402; RK PN: C1005C0G1E102J050BA
C?#100 = CAP NP_Dup1: cap,22.00uF,+/-20%,6.3V,X5R,C0603; Part Reference: C2316; Manufacturer PN: C1608X5R0J226M080AC; Manufacturer: TDK; Tolerance: 20%; Priority: A; PCB Footprint: C0603; Value: 22uF; Created by: JJJ; Part Type: C0603; RK PN: C1608X5R0J226M080AC
D? = DIODE: Schottky BarrierЈ¬B5819WS SOD-323; Part Reference: D2200; Manufacturer: і¤µз; Priority: A; PCB Footprint: SOD_323; Value: B5819WS; Created by: JJJ; Manufacturer PN: B5819WS; Part Type: Schottky rectifier; RK PN: B5819WS
FB? = BEAD: BEAD,120R@100MHz,current=2000mA,0603; Part Reference: FB2300; Manufacturer PN: BLM18KG121TN1; Manufacturer: Murata; Irms: 2A; Tolerance: 25%; DC Resistor: 0.030ohm; Priority: L; PCB Footprint: L0603; Value: 120R-100MHz; Created by: DZS; Part Type: BEAD; RK PN: BLM18KG121TN1
L?#1 = INDUCTORS OF FERRITE: Power Inductor,0.47uH,20%,IND_201610; Part Reference: L2200; Manufacturer PN: WIP201610P-R47ML; Manufacturer: INPAQ; DC Resistor: 33mohm; Isat: 4.4A; Resonace frequency: 1MHz; Irms: 3.3A; Tolerance: 0.2; Priority: A; PCB Footprint: IND_201610; Value: 0.47uH; Created by: JJJ; Part Type: POWER_IND; RK PN: WIP201610P-R47ML
L?#2 = INDUCTORS OF FERRITE: Power Inductor,0.22uH,20%,IND_322512; Part Reference: L2201; Manufacturer: TDK; DC Resistor: 6ohm; Isat: 10A; RK PN: TMS322512ALM-R22MTAA; Priority: A; Tolerance: 0.2; Resonace frequency: 1MHz; PCB Footprint: IND_322512; Value: 0.22uH; Part Type: POWER_IND; Manufacturer PN: TMS322512ALM-R22MTAA; Created by: YWQ
L?#3 = INDUCTORS OF FERRITE: Power Inductor,0.47uH,20%,IND_201610; Part Reference: L2202; Manufacturer PN: WIP201610P-R47ML; Manufacturer: INPAQ; DC Resistor: 33mohm; Isat: 4.4A; Resonace frequency: 1MHz; Irms: 3.3A; Tolerance: 0.2; Priority: A; PCB Footprint: IND_201610; Value: 0.47uH; Created by: JJJ; Part Type: POWER_IND; RK PN: WIP201610P-R47ML
L?#4 = INDUCTORS OF FERRITE: Power Inductor,0.22uH,20%,IND_322512; Part Reference: L2203; Manufacturer PN: TMS322512ALM-R22MTAA; Manufacturer: TDK; DC Resistor: 6ohm; Isat: 10A; Resonace frequency: 1MHz; Tolerance: 0.2; Priority: A; PCB Footprint: IND_322512; Value: 0.22uH; Created by: YWQ; Part Type: POWER_IND; RK PN: TMS322512ALM-R22MTAA
L?#5 = INDUCTORS OF FERRITE: Power Inductor,0.47uH,20%,IND_201610; Part Reference: L2204; Manufacturer: INPAQ; DC Resistor: 33mohm; Isat: 4.4A; RK PN: WIP201610P-R47ML; Priority: A; Tolerance: 0.2; Irms: 3.3A; Resonace frequency: 1MHz; PCB Footprint: IND_201610; Value: 0.47uH; Part Type: POWER_IND; Manufacturer PN: WIP201610P-R47ML; Created by: JJJ
L?#6 = INDUCTORS OF FERRITE: Power Inductor,0.22uH,20%,IND_322512; Part Reference: L2205; Manufacturer PN: TMS322512ALM-R22MTAA; Manufacturer: TDK; DC Resistor: 6ohm; Isat: 10A; Resonace frequency: 1MHz; Tolerance: 0.2; Priority: A; PCB Footprint: IND_322512; Value: 0.22uH; Created by: YWQ; Part Type: POWER_IND; RK PN: TMS322512ALM-R22MTAA
L?#7 = INDUCTORS OF FERRITE: Power Inductor,0.47uH,20%,IND_201610; Part Reference: L2206; Manufacturer: INPAQ; DC Resistor: 33mohm; Isat: 4.4A; RK PN: WIP201610P-R47ML; Priority: A; Tolerance: 0.2; Irms: 3.3A; Resonace frequency: 1MHz; PCB Footprint: IND_201610; Value: 0.47uH; Part Type: POWER_IND; Manufacturer PN: WIP201610P-R47ML; Created by: JJJ
L?#8 = INDUCTORS OF FERRITE: Power Inductor,0.22uH,20%,IND_322512; Part Reference: L2207; Manufacturer: TDK; DC Resistor: 6ohm; Isat: 10A; RK PN: TMS322512ALM-R22MTAA; Priority: A; Tolerance: 0.2; Resonace frequency: 1MHz; PCB Footprint: IND_322512; Value: 0.22uH; Part Type: POWER_IND; Manufacturer PN: TMS322512ALM-R22MTAA; Created by: YWQ
L?#9 = INDUCTORS OF FERRITE: Power Inductor,0.47uH,20%,IND_201610; Part Reference: L2208; Manufacturer PN: WIP201610P-R47ML; Manufacturer: INPAQ; DC Resistor: 33mohm; Isat: 4.4A; Resonace frequency: 1MHz; Irms: 3.3A; Tolerance: 0.2; Priority: A; PCB Footprint: IND_201610; Value: 0.47uH; Created by: JJJ; Part Type: POWER_IND; RK PN: WIP201610P-R47ML
L?#10 = INDUCTORS OF FERRITE: Power Inductor,0.47uH,20%,IND_201610; Part Reference: L2209; Manufacturer PN: WIP201610P-R47ML; Manufacturer: INPAQ; DC Resistor: 33mohm; Isat: 4.4A; Resonace frequency: 1MHz; Irms: 3.3A; Tolerance: 0.2; Priority: A; PCB Footprint: IND_201610; Value: 0.47uH; Created by: JJJ; Part Type: POWER_IND; RK PN: WIP201610P-R47ML
L?#11 = INDUCTORS OF FERRITE: Power Inductor,0.22uH,20%,IND_322512; Part Reference: L2300; Manufacturer: TDK; DC Resistor: 6ohm; Isat: 10A; RK PN: TMS322512ALM-R22MTAA; Priority: A; Tolerance: 0.2; Resonace frequency: 1MHz; PCB Footprint: IND_322512; Value: 0.22uH; Part Type: POWER_IND; Manufacturer PN: TMS322512ALM-R22MTAA; Created by: YWQ
L?#12 = INDUCTORS OF FERRITE: Power Inductor,0.22uH,20%,IND_322512; Part Reference: L2303; Manufacturer: TDK; DC Resistor: 6ohm; Isat: 10A; RK PN: TMS322512ALM-R22MTAA; Priority: A; Tolerance: 0.2; Resonace frequency: 1MHz; PCB Footprint: IND_322512; Value: 0.22uH; Part Type: POWER_IND; Manufacturer PN: TMS322512ALM-R22MTAA; Created by: YWQ
L?#13 = INDUCTORS OF FERRITE_Dup1: Power Inductor,2.2uH,0.2,IND_404026; Part Reference: L2302; Manufacturer PN: SWPA4026S2R2MT; Manufacturer: sunlord; Isat: 2.10A; DC Resistor: 0.04ohm; Resonace frequency: 96M; Irms: 2A; Tolerance: 20%; Priority: A; PCB Footprint: IND_404026; Value: 2.2uH; Created by: YTL; Part Type: POWER_IND; RK PN: SWPA4026S2R2MT
L?#14 = INDUCTORS OF FERRITE: Power Inductor,0.22uH,20%,IND_322512; Part Reference: L2301; Manufacturer: TDK; DC Resistor: 6ohm; Isat: 10A; RK PN: TMS322512ALM-R22MTAA; Priority: A; Tolerance: 0.2; Resonace frequency: 1MHz; PCB Footprint: IND_322512; Value: 0.22uH; Part Type: POWER_IND; Manufacturer PN: TMS322512ALM-R22MTAA; Created by: YWQ
R?#1 = RESISTOR_Dup2: НЁУГєсД¤µзЧи,100R,+/-5%,R0402,1/16W.; Part Reference: R2200; Manufacturer PN: RC0402JR-07100RL; Manufacturer: YAGEO; Wattage: 1/16W; Priority: A; PCB Footprint: R0402; Value: 100R; Created by: YTL; Part Type: НЁУГєсД¤µзЧи; RK PN: RC0402JR-07100RL
R?#2 = RESISTOR_Dup2: НЁУГєсД¤µзЧи,100R,+/-5%,R0402,1/16W.; Part Reference: R2201; Manufacturer: YAGEO; RK PN: RC0402JR-07100RL; Priority: A; Wattage: 1/16W; PCB Footprint: R0402; Value: 100R; Part Type: НЁУГєсД¤µзЧи; Manufacturer PN: RC0402JR-07100RL; Created by: YTL
R?#3 = RESISTOR_Dup1: НЁУГєсД¤µзЧи,120K,+/-1%,R0402,1/16W.; Part Reference: R2202; Manufacturer: YAGEO; RK PN: RC0402FR-07120KL; Priority: A; Wattage: 1/16W; PCB Footprint: R0402; Value: 120K; Part Type: НЁУГєсД¤µзЧи; Manufacturer PN: RC0402FR-07120KL; Created by: YTL
R?#4 = RESISTOR_Dup2: НЁУГєсД¤µзЧи,100R,+/-5%,R0402,1/16W.; Part Reference: R2203; Manufacturer PN: RC0402JR-07100RL; Manufacturer: YAGEO; Wattage: 1/16W; Priority: A; PCB Footprint: R0402; Value: 100R; Created by: YTL; Part Type: НЁУГєсД¤µзЧи; RK PN: RC0402JR-07100RL
R?#5 = RESISTOR_Dup1: НЁУГєсД¤µзЧи,100K,+/-1%,R0402,1/16W.; Part Reference: R2204; Manufacturer PN: RC0402FR-07100KL; Manufacturer: YAGEO; Wattage: 1/16W; Priority: A; PCB Footprint: R0402; Value: 100K; Created by: YTL; Part Type: НЁУГєсД¤µзЧи; RK PN: RC0402FR-07100KL
R?#6 = RESISTOR_Dup1: НЁУГєсД¤µзЧи,20K,+/-1%,R0402,1/16W.; Part Reference: R2207; Manufacturer PN: RC0402FR-0720KL; Manufacturer: YAGEO; Wattage: 1/16W; Priority: A; PCB Footprint: R0402; Value: 20K; Created by: YTL; Part Type: НЁУГєсД¤µзЧи; RK PN: RC0402FR-0720KL
R?#7 = RESISTOR_Dup2: НЁУГєсД¤µзЧи,100R,+/-5%,R0402,1/16W.; Part Reference: R2206; Manufacturer: YAGEO; RK PN: RC0402JR-07100RL; Priority: A; Wattage: 1/16W; PCB Footprint: R0402; Value: 100R; Part Type: НЁУГєсД¤µзЧи; Manufacturer PN: RC0402JR-07100RL; Created by: YTL
R?#8 = RESISTOR_Dup1: НЁУГєсД¤µзЧи,100K,+/-1%,R0402,1/16W.; Part Reference: R2208; Manufacturer: YAGEO; RK PN: RC0402FR-07100KL; Priority: A; Wattage: 1/16W; PCB Footprint: R0402; Value: 100K; Part Type: НЁУГєсД¤µзЧи; Manufacturer PN: RC0402FR-07100KL; Created by: YTL
R?#9 = RESISTOR_Dup2: НЁУГєсД¤µзЧи,100R,+/-5%,R0402,1/16W.; Part Reference: R2209; Manufacturer: YAGEO; RK PN: RC0402JR-07100RL; Priority: A; Wattage: 1/16W; PCB Footprint: R0402; Value: 100R; Part Type: НЁУГєсД¤µзЧи; Manufacturer PN: RC0402JR-07100RL; Created by: YTL
R?#10 = RESISTOR_Dup2: НЁУГєсД¤µзЧи,0R,+/-5%,R0805,1/8W.; Part Reference: R2210; Manufacturer PN: RC0805JR-070RL; Manufacturer: YAGEO; Wattage: 1/8W; Priority: A; Value: 0R; Created by: YTL; Part Type: НЁУГєсД¤µзЧи; RK PN: RC0805JR-070RL
R?#11 = RESISTOR_Dup2: НЁУГєсД¤µзЧи,0R,+/-5%,R0805,1/8W.; Part Reference: R2211; Manufacturer: YAGEO; RK PN: RC0805JR-070RL; Priority: A; Wattage: 1/8W; Value: 0R; Part Type: НЁУГєсД¤µзЧи; Manufacturer PN: RC0805JR-070RL; Created by: YTL
R?#12 = RESISTOR_Dup2: НЁУГєсД¤µзЧи,100K,+/-5%,R0402,1/16W.; Part Reference: R2350; Manufacturer: YAGEO; RK PN: RC0402JR-07100KL; Priority: A; Wattage: 1/16W; PCB Footprint: R0402; Value: 100K; Part Type: НЁУГєсД¤µзЧи; Manufacturer PN: RC0402JR-07100KL; Created by: YTL
R?#13 = RESISTOR_Dup2: НЁУГєсД¤µзЧи,4K7,+/-5%,R0402,1/16W.; Part Reference: R2322; Manufacturer PN: RC0402JR-074K7L; Manufacturer: YAGEO; Wattage: 1/16W; Priority: A; PCB Footprint: R0402; Value: 4.7K; Created by: YTL; Part Type: НЁУГєсД¤µзЧи; RK PN: RC0402JR-074K7L
R?#14 = RESISTOR_Dup2: НЁУГєсД¤µзЧи,10K,+/-5%,R0402,1/16W.; Part Reference: R2311; Manufacturer: YAGEO; RK PN: RC0402JR-0710KL; Priority: A; Wattage: 1/16W; PCB Footprint: R0402; Value: 10K; Part Type: НЁУГєсД¤µзЧи; Manufacturer PN: RC0402JR-0710KL; Created by: YTL
R?#15 = RESISTOR_Dup2: НЁУГєсД¤µзЧи,100R,+/-5%,R0402,1/16W.; Part Reference: R2300; Manufacturer PN: RC0402JR-07100RL; Manufacturer: YAGEO; Wattage: 1/16W; Priority: A; PCB Footprint: R0402; Value: 100R; Created by: YTL; Part Type: НЁУГєсД¤µзЧи; RK PN: RC0402JR-07100RL
R?#16 = RESISTOR_Dup2: НЁУГєсД¤µзЧи,100R,+/-5%,R0402,1/16W.; Part Reference: R2306; Manufacturer PN: RC0402JR-07100RL; Manufacturer: YAGEO; Wattage: 1/16W; Priority: A; PCB Footprint: R0402; Value: 100R; Created by: YTL; Part Type: НЁУГєсД¤µзЧи; RK PN: RC0402JR-07100RL
R?#17 = RESISTOR_Dup2: НЁУГєсД¤µзЧи,100K,+/-1%,R0402,1/16W.; Part Reference: R2305; Manufacturer PN: RC0402FR-07100KL; Manufacturer: YAGEO; Wattage: 1/16W; Priority: A; PCB Footprint: R0402; Value: 100K; Created by: YTL; Part Type: НЁУГєсД¤µзЧи; RK PN: RC0402FR-07100KL
R?#18 = RESISTOR_Dup2: НЁУГєсД¤µзЧи,10K,+/-5%,R0402,1/16W.; Part Reference: R2304; Manufacturer PN: RC0402JR-0710KL; Manufacturer: YAGEO; Wattage: 1/16W; Priority: A; PCB Footprint: R0402; Value: 10K; Created by: YTL; Part Type: НЁУГєсД¤µзЧи; RK PN: RC0402JR-0710KL
R?#19 = RESISTOR_Dup2: НЁУГєсД¤µзЧи,120K,+/-1%,R0402,1/16W.; Part Reference: R2307; Manufacturer PN: RC0402FR-07120KL; Manufacturer: YAGEO; Wattage: 1/16W; Priority: A; PCB Footprint: R0402; Value: 120K; Created by: YTL; Part Type: НЁУГєсД¤µзЧи; RK PN: RC0402FR-07120KL
R?#20 = RESISTOR_Dup2: НЁУГєсД¤µзЧи,100K,+/-5%,R0402,1/16W.; Part Reference: R2302; Manufacturer PN: RC0402JR-07100KL; Manufacturer: YAGEO; Wattage: 1/16W; Priority: A; PCB Footprint: R0402; Value: 100K; Created by: YTL; Part Type: НЁУГєсД¤µзЧи; RK PN: RC0402JR-07100KL
R?#21 = RESISTOR_Dup2: НЁУГєсД¤µзЧи,120K,+/-5%,R0402,1/16W.; Part Reference: R2303; Manufacturer PN: RC0402JR-07120KL; Manufacturer: YAGEO; Wattage: 1/16W; Priority: A; PCB Footprint: R0402; Value: 120K; Created by: YTL; Part Type: НЁУГєсД¤µзЧи; RK PN: RC0402JR-07120KL
R?#22 = RESISTOR_Dup1: НЁУГєсД¤µзЧи,100K,+/-5%,R0402,1/16W.; Part Reference: R2212; Manufacturer PN: RC0402JR-07100KL; Manufacturer: YAGEO; Wattage: 1/16W; Priority: A; PCB Footprint: R0402; Value: 100K; Created by: YTL; Part Type: НЁУГєсД¤µзЧи; RK PN: RC0402JR-07100KL
R?#23 = RESISTOR_Dup1: НЁУГєсД¤µзЧи,100K,+/-5%,R0402,1/16W.; Part Reference: R2213; Manufacturer: YAGEO; RK PN: RC0402JR-07100KL; Priority: A; Wattage: 1/16W; PCB Footprint: R0402; Value: 100K; Part Type: НЁУГєсД¤µзЧи; Manufacturer PN: RC0402JR-07100KL; Created by: YTL
R?#24 = RESISTOR_Dup2: НЁУГєсД¤µзЧи,100R,+/-5%,R0402,1/16W.; Part Reference: R2301; Manufacturer PN: RC0402JR-07100RL; Manufacturer: YAGEO; Wattage: 1/16W; Priority: A; PCB Footprint: R0402; Value: 100R; Created by: YTL; Part Type: НЁУГєсД¤µзЧи; RK PN: RC0402JR-07100RL
R?#25 = RESISTOR_Dup1: НЁУГєсД¤µзЧи,10K,+/-5%,R0402,1/16W.; Part Reference: R2214; Manufacturer PN: RC0402JR-0710KL; Manufacturer: YAGEO; Wattage: 1/16W; Priority: A; PCB Footprint: R0402; Value: 10K; Created by: YTL; Part Type: НЁУГєсД¤µзЧи; RK PN: RC0402JR-0710KL
R?#26 = RESISTOR_Dup1: НЁУГєсД¤µзЧи,10K,+/-5%,R0402,1/16W.; Part Reference: R2215; Manufacturer PN: RC0402JR-0710KL; Manufacturer: YAGEO; Wattage: 1/16W; Priority: A; PCB Footprint: R0402; Value: 10K; Created by: YTL; Part Type: НЁУГєсД¤µзЧи; RK PN: RC0402JR-0710KL
R?#27 = RESISTOR_Dup2: НЁУГєсД¤µзЧи,200K,+/-5%,R0402,1/16W.; Part Reference: R2216; Manufacturer PN: RC0402JR-07200KL; Manufacturer: YAGEO; Wattage: 1/16W; Priority: A; PCB Footprint: R0402; Value: 200K; Created by: YTL; Part Type: НЁУГєсД¤µзЧи; RK PN: RC0402JR-07200KL
R?#28 = RESISTOR_Dup2: НЁУГєсД¤µзЧи,200K,+/-5%,R0402,1/16W.; Part Reference: R2217; Manufacturer PN: RC0402JR-07200KL; Manufacturer: YAGEO; Wattage: 1/16W; Priority: A; PCB Footprint: R0402; Value: 200K; Created by: YTL; Part Type: НЁУГєсД¤µзЧи; RK PN: RC0402JR-07200KL
U?#1 U?#2 U?#7 = PMIC_RK806: ROCKCHIP PMIC RK806-1; Part Reference: U2200; Manufacturer: Rockchip (ИрРѕОў); Priority: A; Value: RK806-1; PCB Footprint: QFN68_7R00X7R00X0R80_T; RK PN: RK806-1; Part Type: PMIC; Manufacturer PN: RK806-1; Created by: YWQ
U?#3 = SWITCH_SY6280: 1A Current Limited Load Switch; Part Reference: U2305; Manufacturer PN: TT9107; Manufacturer: Torch-chipЈЁМАіПµзЧУЈ©; Priority: A; PCB Footprint: SOT_23_5; Value: SGM2576/TT9107; Created by: JJJ; Part Type: Switch; RK PN: TT9107
U?#4 = DCDC_RK860: I2C-ADDR 42HЈ»Vout 0.5-1.5VЈ»Default Vout 0.8VЈ»Step 6.25mVЈ»Die_ID 0XA;; Part Reference: U2300; Manufacturer: Rockchip (ИрРѕОў); Priority: A; Value: RK860-2; Created by: YWQ; Manufacturer PN: RK860-2; Part Type: DCDC; RK PN: RK860-2
U?#5 = DCDC_RK860: I2C-ADDR 42HЈ»Vout 0.5-1.5VЈ»Default Vout 0.8VЈ»Step 6.25mVЈ»Die_ID 0XA;; Part Reference: U2303; Manufacturer: Rockchip (ИрРѕОў); Priority: A; Value: RK860-2; Created by: YWQ; Manufacturer PN: RK860-2; Part Type: DCDC; RK PN: RK860-2
U?#6 = DCDC_SY8088: High Efficiency 5.5V, 2A continuous, 3A peak, 1MHz Synchronous Step Down Regulator; Part Reference: U2302; Manufacturer: SilergyЈЁОщБ¦ЅЬЈ©; Priority: A; PCB Footprint: SOT_23_5; Value: ETA3409/SY8089AAC; Created by: JJJ; Manufacturer PN: SY8089AAC; Part Type: DCDC; RK PN: SY8089AAC
U?#8 = DCDC_RK860: I2C-ADDR 43HЈ»Vout 0.5-1.5VЈ»Default Vout 0.8VЈ»Step 6.25mVЈ»Die_ID 0XA;; Part Reference: U2301; Manufacturer: Rockchip (ИрРѕОў); Priority: A; Value: RK860-3; Created by: YWQ; Manufacturer PN: RK860-3; Part Type: DCDC; RK PN: RK860-3